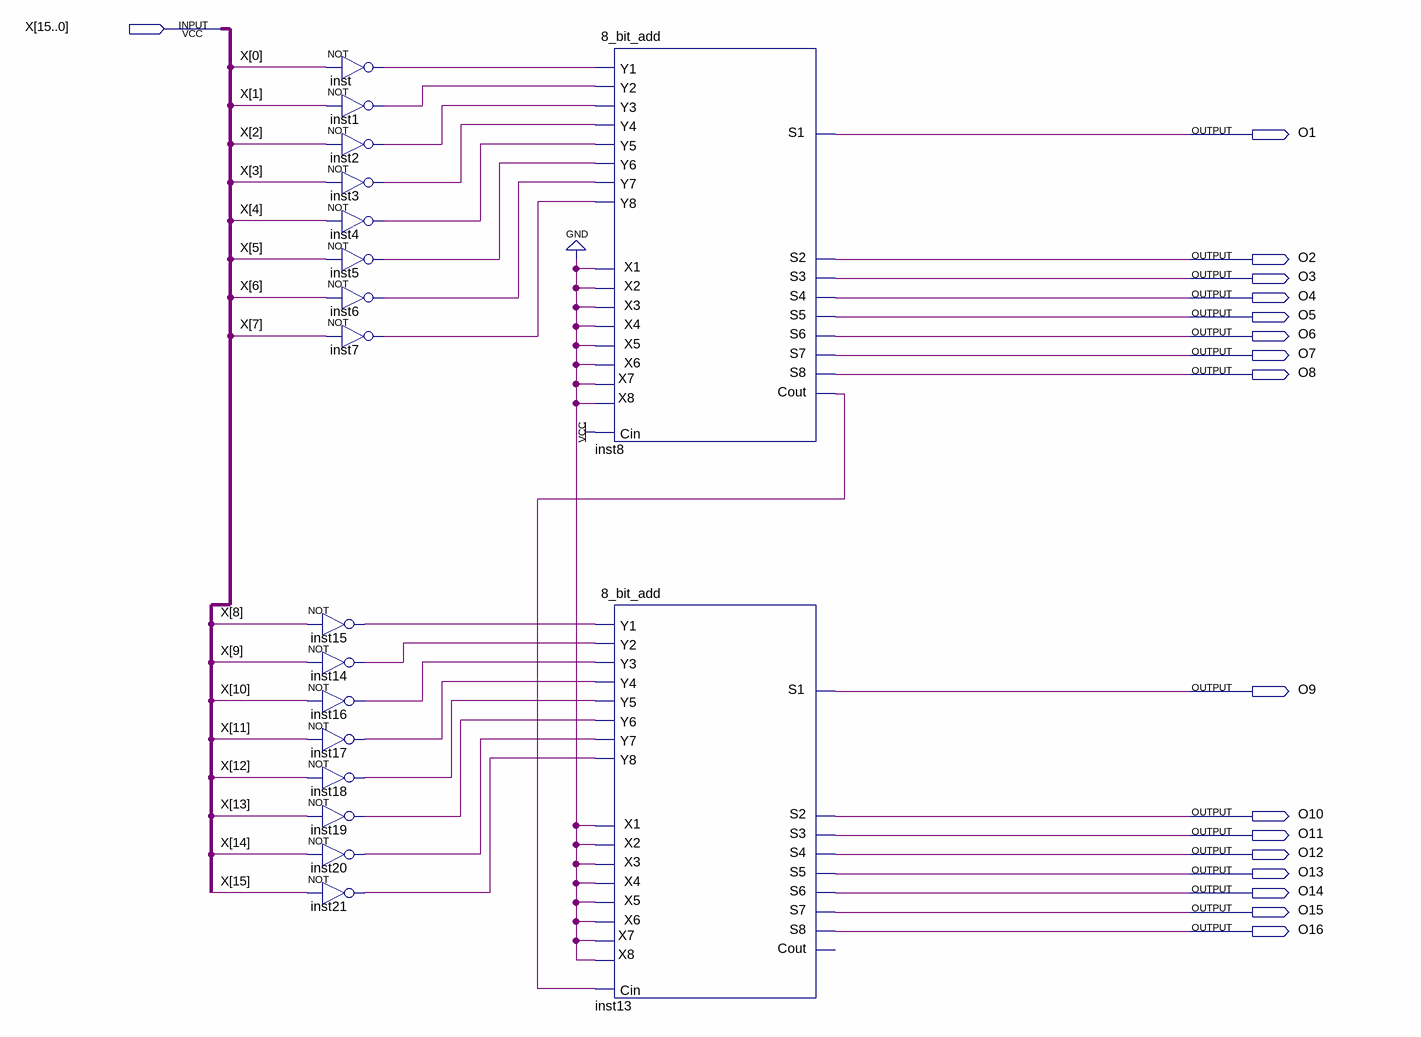
[diagram p0: schematic sheet]
// Quartus schematic 2s_CompX16.bdf as structural Verilog: 18 symbols, 17 pins
module \2s_CompX16  (
  input  [15:0] X,
  output O1,
  output O2,
  output O3,
  output O4,
  output O5,
  output O6,
  output O7,
  output O8,
  output O9,
  output O10,
  output O11,
  output O12,
  output O13,
  output O14,
  output O15,
  output O16
);

  wire inst1_out, inst2_out, inst3_out, inst4_out, inst5_out, inst6_out, inst7_out, inst8_cout, inst14_out,
       inst15_out, inst16_out, inst17_out, inst18_out, inst19_out, inst20_out, inst21_out, inst_out;

  not inst (inst_out, X[0]);
  not inst1 (inst1_out, X[1]);
  not inst2 (inst2_out, X[2]);
  not inst3 (inst3_out, X[3]);
  not inst4 (inst4_out, X[4]);
  not inst5 (inst5_out, X[5]);
  not inst6 (inst6_out, X[6]);
  not inst7 (inst7_out, X[7]);
  not inst15 (inst15_out, X[8]);
  not inst14 (inst14_out, X[9]);
  not inst16 (inst16_out, X[10]);
  not inst17 (inst17_out, X[11]);
  not inst18 (inst18_out, X[12]);
  not inst19 (inst19_out, X[13]);
  not inst20 (inst20_out, X[14]);
  not inst21 (inst21_out, X[15]);
  \8_bit_add  inst8 (
    .Y1(inst_out), .X1(1'b0), .X2(1'b0), .X3(1'b0), .X4(1'b0), .Y2(inst1_out), .Y3(inst2_out),
    .Y4(inst3_out), .X5(1'b0), .Y5(inst4_out), .X6(1'b0), .Y6(inst5_out), .X7(1'b0), .Y7(inst6_out),
    .X8(1'b0), .Y8(inst7_out), .Cin(1'b1), .Cout(inst8_cout), .S1(O1), .S2(O2), .S3(O3), .S4(O4), .S5(O5),
    .S6(O6), .S7(O7), .S8(O8));
  \8_bit_add  inst13 (
    .Y1(inst15_out), .X1(1'b0), .X2(1'b0), .X3(1'b0), .X4(1'b0), .Y2(inst14_out), .Y3(inst16_out),
    .Y4(inst17_out), .X5(1'b0), .Y5(inst18_out), .X6(1'b0), .Y6(inst19_out), .X7(1'b0), .Y7(inst20_out),
    .X8(1'b0), .Y8(inst21_out), .Cin(inst8_cout), .S1(O9), .S2(O10), .S3(O11), .S4(O12), .S5(O13), .S6(O14),
    .S7(O15), .S8(O16));  // open: Cout
endmodule
